# Altium schematic sheet ADCMP.SchDoc
size A4; SheetNumber: 4; SheetTotal: 5
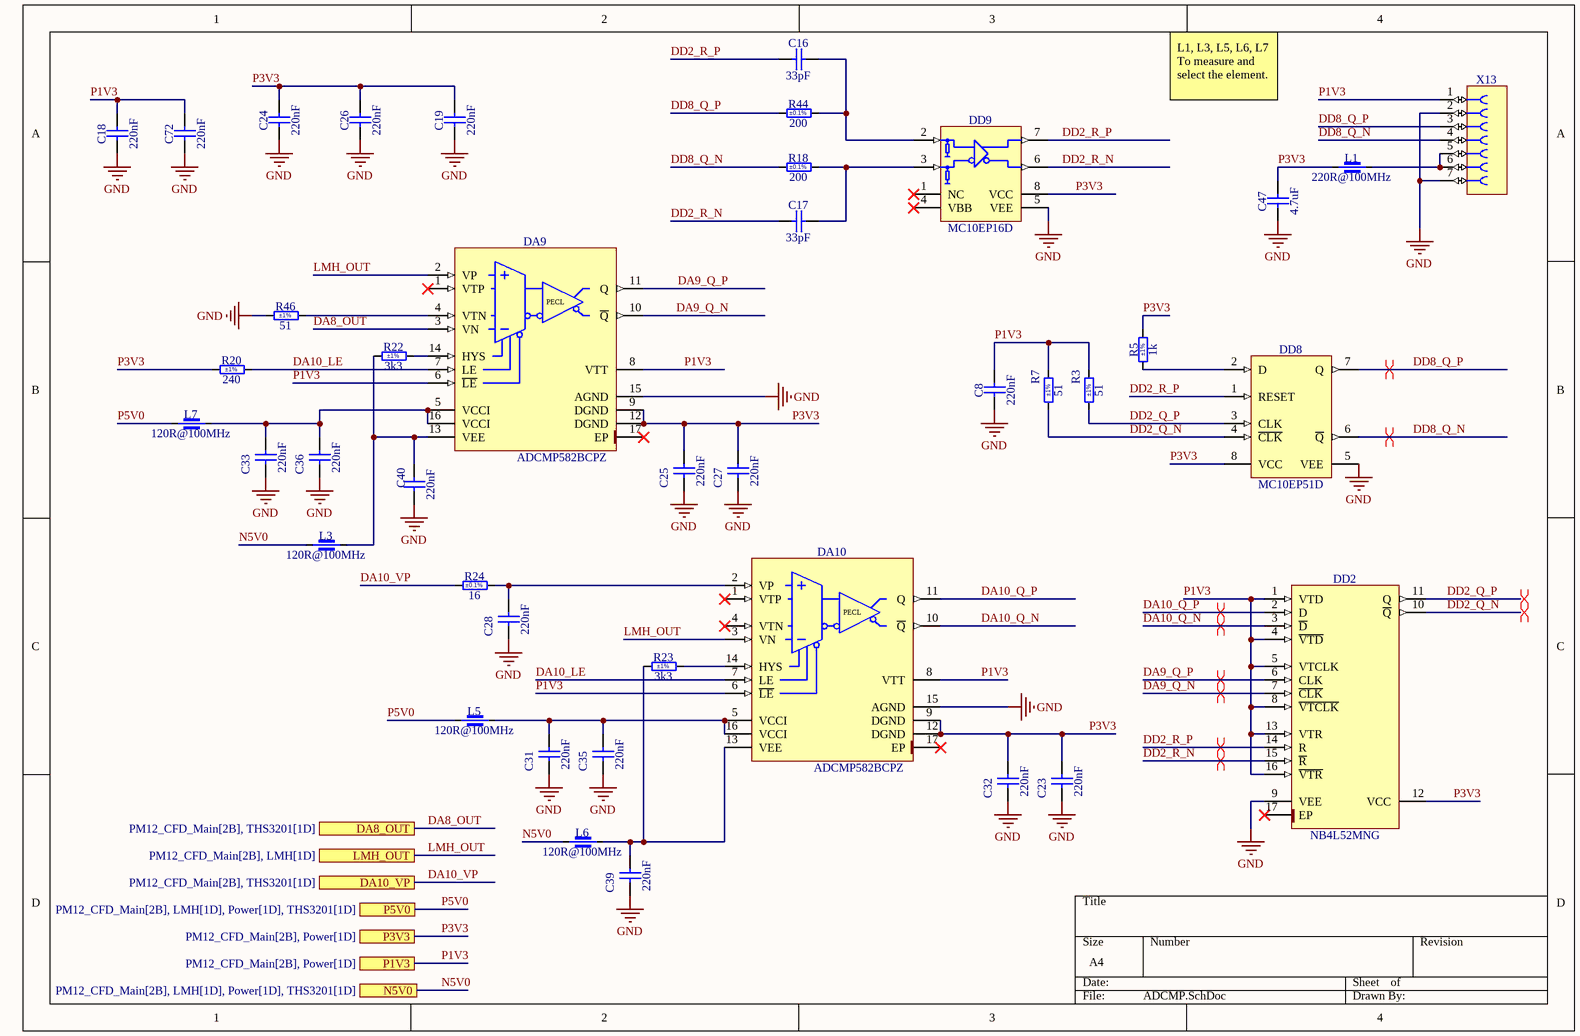
[diagram p0: ADCMP.SchDoc]

## Parts
C8  220nF  [CAPC2012X135N]
C16  33pF  [CAPC2012X135N]
C17  33pF  [CAPC2012X135N]
C18  220nF  [CAPC1608X87N]
C19  220nF  [CAPC2012X135N]
C23  220nF  [CAPC1608X87N]
C24  220nF  [CAPC2012X135N]
C25  220nF  [CAPC1608X87N]
C26  220nF  [CAPC2012X135N]
C27  220nF  [CAPC1608X87N]
C28  220nF  [CAPC1608X87N]
C31  220nF  [CAPC1608X87N]
C32  220nF  [CAPC1608X87N]
C33  220nF  [CAPC1608X87N]
C35  220nF  [CAPC1608X87N]
C36  220nF  [CAPC1608X87N]
C39  220nF  [CAPC1608X87N]
C40  220nF  [CAPC1608X87N]
C47  4.7uF  [CAPC3216X180N]
C72  220nF  [CAPC2012X135N]
DA9  ADCMP582BCPZ  [QFN50P300X300X80-17N-S145]
DA10  ADCMP582BCPZ  [QFN50P300X300X80-17N-S145]
DD2  NB4L52MNG  [QFN50P300X300X100-17N-S185]
DD8  MC10EP51D  [SOIC127P600X175-8N]
DD9  MC10EP16D  [SOIC127P600X175-8N]
L1  220R@100MHz  [INDC2012X105N]
L3  120R@100MHz  [INDC1608X95N]
L5  120R@100MHz  [INDC1608X95N]
L6  120R@100MHz  [INDC1608X95N]
L7  120R@100MHz  [INDC1608X95N]
R3  51  Tolerance: ±1%  [RESC2012X60N]
R5  1k  Tolerance: ±1%  [RESC2012X60N]
R7  51  Tolerance: ±1%  [RESC2012X60N]
R18  200  Tolerance: ±0.1%  [RESC2012X60N]
R20  240  Tolerance: ±1%  [RESC1608X55N]
R22  3k3  Tolerance: ±1%  [RESC1608X55N]
R23  3k3  Tolerance: ±1%  [RESC1608X55N]
R24  16  Tolerance: ±0.1%  [RESC1608X64N]
R44  200  Tolerance: ±0.1%  [RESC2012X60N]
R46  51  Tolerance: ±1%  [RESC1608X55N]
X13  Socket 7  [SAMTEC_CES-107-01-T-S]  (value not drawn)

## Ports
DA8_OUT (see PM12_CFD_Main[2B], THS3201[1D]), DA10_VP (see PM12_CFD_Main[2B], THS3201[1D]), LMH_OUT (see PM12_CFD_Main[2B], LMH[1D]), N5V0 (see PM12_CFD_Main[2B], LMH[1D], Power[1D], THS3201[1D]), P1V3 (see PM12_CFD_Main[2B], Power[1D]), P3V3 (see PM12_CFD_Main[2B], Power[1D]), P5V0 (see PM12_CFD_Main[2B], LMH[1D], Power[1D], THS3201[1D])

## Nets
GND: C8.1 C18.1 C19.1 C23.1 C24.1 C25.1 C26.1 C27.1 C28.1 C31.1 C32.1 C33.1 C35.1 C36.1 C39.1 C40.1 C47.1 C72.1 DA9.15(AGND) DA10.15(AGND) DD2.9(VEE) DD8.5(VEE) DD9.5(VEE) R46.1 X13.2 X13.7
DA8_OUT: DA9.3(VN) ; port DA8_OUT
DA9_Q_N: DA9.10(~{Q}) DD2.7(~{CLK})
DA9_Q_P: DA9.11(Q) DD2.6(CLK)
DA10_LE: DA9.7(LE) DA10.7(LE) R20.2
DA10_Q_N: DA10.10(~{Q}) DD2.3(~{D})
DA10_Q_P: DA10.11(Q) DD2.2(D)
DA10_VP: R24.1 ; port DA10_VP
DD2_Q_N: DD2.10(~{Q}) DD8.4(~{CLK}) R7.1
DD2_Q_P: DD2.11(Q) DD8.3(CLK) R3.1
DD2_R_N: C17.1 DD2.15(~{R}) DD9.6(~{Q})
DD2_R_P: C16.1 DD2.14(R) DD8.1(RESET) DD9.7(Q)
DD8_Q_N: DD8.6(~{Q}) R18.1 X13.4
DD8_Q_P: DD8.7(Q) R44.1 X13.3
LMH_OUT: DA9.2(VP) DA10.3(VN) ; port LMH_OUT
N5V0: L3.1 L6.1 ; port N5V0
P1V3: C8.2 C18.2 C72.2 DA9.6(~{LE}) DA9.8(VTT) DA10.6(~{LE}) DA10.8(VTT) DD2.1(VTD) DD2.4(~{VTD}) DD2.5(VTCLK) DD2.8(~{VTCLK}) DD2.13(VTR) DD2.16(~{VTR}) R3.2 R7.2 X13.1 ; port P1V3
P3V3: C19.2 C23.2 C24.2 C25.2 C26.2 C27.2 C32.2 C47.2 DA9.9(DGND) DA9.12(DGND) DA10.9(DGND) DA10.12(DGND) DD2.12(VCC) DD8.8(VCC) DD9.8(VCC) L1.1 R5.2 R20.1 ; port P3V3
P5V0: L5.1 L7.1 ; port P5V0
NetC16_2: C16.2 DD9.2(D0) R44.2
NetC17_2: C17.2 DD9.3(~{D0}) R18.2
NetC28_2: C28.2 DA10.2(VP) R24.2
NetC31_2: C31.2 C35.2 DA10.5(VCCI) DA10.16(VCCI) L5.2
NetC33_2: C33.2 C36.2 DA9.5(VCCI) DA9.16(VCCI) L7.2
NetC39_2: C39.2 DA10.13(VEE) L6.2 R23.1
NetC40_2: C40.2 DA9.13(VEE) L3.2 R22.1
NetDA9_4: DA9.4(VTN) R46.2
NetDA9_14: DA9.14(HYS) R22.2
NetDA10_14: DA10.14(HYS) R23.2
NetDD8_2: DD8.2(D) R5.1
NetL1_2: L1.2 X13.5 X13.6

Not connected (* = marked no-connect by the designer): DA9 1(VTP)* 17(EP)*; DA10 1(VTP)* 4(VTN)* 17(EP)*; DD2 17(EP)*; DD9 1(NC)* 4(VBB)*

## Layout directives
differential pair: DA9_Q_N, DA9_Q_P, DA10_Q_N, DA10_Q_P, DD2_Q_N, DD2_Q_P, DD2_R_N, DD2_R_P, DD8_Q_N, DD8_Q_P

## Notes on the sheet
- L1, L3, L5, L6, L7 To measure and select the element.
- (in symbol ADCMP582BCPZ) PECL

## Library data of the parts
C8 C19 C24 C26 C72 = CC0805_220NF_50V_10%_X7R: Non-polarised capacitor; Part Description: SMD Multilayer Chip Ceramic Capacitor; Manufacturer: GENERIC; Manufacturer1 Part Number: GRM21BR71H224KA01L; Voltage: 50V; TC: X7R; Tolerance: ±10%; Part Number: CC0805_220NF_50V_10%_X7R; Component Kind: Standard; Component Type: Standard; Pin Count: 2; Value: 220nF; Status: Preferred; Manufacturer Part Number: CC0805_220NF_50V_10%_X7R; Case: 0805; Mounted: Yes; Socket: No; SMD: Yes; Sense: No; Manufacturer1 Example: MURATA; Manufacturer1 ComponentHeight: 1.35mm; HelpURL: \\cern.ch\dfs\Applications\Altium\Datasheets\CC0805_X7R_MURATA.pdf; Author: CERN DEM JLC; CreateDate: 03.12.2007; LatestRevisionDate: 03.12.2007
C16 C17 = CC0805_33PF_50V_5%_NP0: Non-polarised capacitor; Part Description: SMD Multilayer Chip Ceramic Capacitor; Manufacturer: GENERIC; Manufacturer1 Part Number: 223886115339; Voltage: 50V; TC: C0G/NP0; Tolerance: ±5%; Part Number: CC0805_33PF_50V_5%_NP0; Component Kind: Standard; Component Type: Standard; Pin Count: 2; Value: 33pF; Status: Preferred; Manufacturer Part Number: CC0805_33PF_50V_5%_NP0; Case: 0805; Mounted: Yes; Socket: No; SMD: Yes; Sense: No; Manufacturer1 Example: PHYCOMP; Manufacturer1 ComponentHeight: 1.35mm; HelpURL: \\cern.ch\dfs\Applications\Altium\Datasheets\CC0805_NP0_PHYCOMP.pdf; Author: CERN DEM JLC; CreateDate: 03.12.2007; LatestRevisionDate: 03.12.2007
C18 C23 C25 C27 C28 C31-C33 C35 C36 C39 C40 = CC0603_220NF_25V_10%_X7R: Non-polarised capacitor; Part Description: SMD Multilayer Chip Ceramic Capacitor; Manufacturer: GENERIC; Manufacturer1 Part Number: C0603C224K3RACTU; Voltage: 25V; TC: X7R; Tolerance: ±10%; Part Number: CC0603_220NF_25V_10%_X7R; Component Kind: Standard; Component Type: Standard; Pin Count: 2; Value: 220nF; Status: Preferred; Manufacturer Part Number: CC0603_220NF_25V_10%_X7R; Case: 0603; Mounted: Yes; Socket: No; SMD: Yes; Sense: No; Manufacturer1 Example: KEMET; Manufacturer1 ComponentHeight: 0.87mm; HelpURL: \\cern.ch\dfs\Applications\Altium\Datasheets\CC0603_X7R_KEMET.pdf; Author: CERN DEM JLC; CreateDate: 29.10.2014; LatestRevisionDate: 29.10.2014
C47 = CC1206_4.7UF_25V_10%_X7R: Non-polarised capacitor; Part Description: SMD Multilayer Chip Ceramic Capacitor; Manufacturer: GENERIC; Manufacturer1 Part Number: C1206C475K3RAC; Voltage: 25V; TC: X7R; Tolerance: ±10%; Part Number: CC1206_4.7UF_25V_10%_X7R; Component Kind: Standard; Component Type: Standard; Pin Count: 2; Value: 4.7uF; Status: Preferred; Manufacturer Part Number: CC1206_4.7UF_25V_10%_X7R; Case: 1206; Mounted: Yes; Socket: No; SMD: Yes; Sense: No; Manufacturer1 Example: KEMET; Manufacturer1 ComponentHeight: 1.8mm; HelpURL: \\cern.ch\dfs\Applications\Altium\Datasheets\CC1206_X7R_KEMET.pdf; Author: CERN DEM WB; CreateDate: 25.07.2018; LatestRevisionDate: 25.07.2018
DA9 DA10 = ADCMP582BCPZ: Ultrafast SiGe Voltage Comparator; Manufacturer: ANALOG DEVICES; PressFit: No; Bonding: No; Part Number: ADCMP582BCPZ; Component Kind: Standard; Component Type: Standard; Device: ADCMP582BCPZ; PackageDescription: QFN, 0.50mm Pitch, Square; 16 Pin, 3.00mm L X 3.00mm W X 0.80mm H body (w/Thermal Tab 1.45 X 1.45mm), IPC Medium Density; Part Description: Ultrafast SiGe Voltage Comparator; Manufacturer Part Number: ADCMP582BCP; Pin Count: 17; Case: QFN16; Mounted: Yes; Socket: No; SMD: Yes; Sense: No; ComponentHeight: 0.8mm; Author: CERN DEM MR; HelpURL: \\cern.ch\dfs\Applications\Altium\Datasheets\ADCMP582BCPZ.pdf; CreateDate: 23.01.2018; LatestRevisionDate: 31.03.2022
DD2 = NB4L52MNG: 2.5 V/3.3 V/5.0 V Differential Data/Clock D Flip-Flop with Reset; Manufacturer: ON SEMICONDUCTOR; PressFit: No; Bonding: No; Part Number: NB4L52MNG; Component Kind: Standard; Component Type: Standard; Device: NB4L52MNG; PackageDescription: QFN, 0.50mm Pitch, Square; 16 Pin, 3.00mm L X 3.00mm W X 1.00mm H body (w/Thermal Tab 1.85 X 1.85mm), IPC Medium Density; Part Description: 2.5 V/3.3 V/5.0 V Differential Data/Clock D Flip-Flop with Reset; Manufacturer Part Number: NB4L52MN; Pin Count: 16; Case: QFN16; Mounted: Yes; Socket: No; SMD: Yes; Sense: No; ComponentHeight: 1mm; Author: CERN DEM MR; HelpURL: \\cern.ch\dfs\Applications\Altium\Datasheets\NB4L52MNG.pdf; CreateDate: 15.01.2016; LatestRevisionDate: 04.04.2022
DD8 = MC10EP51D: 3.3V/5V ECL D Flip-Flop with Reset and Differential Clock; Manufacturer: ON SEMICONDUCTOR; PressFit: No; Bonding: No; Part Number: MC10EP51D; Component Kind: Standard; Component Type: Standard; Device: MC10EP51D; PackageDescription: SOIC 8, Pitch 1.27mm - Body 4x5mm, IPC Medium Density; Part Description: 3.3V/5V ECL D Flip-Flop with Reset and Differential Clock; Manufacturer Part Number: MC10EP51D; Pin Count: 8; Case: SOIC8; Mounted: Yes; Socket: No; SMD: Yes; Sense: No; ComponentHeight: 1.75mm; Author: CERN DEM HF; HelpURL: \\cern.ch\dfs\Applications\Altium\Datasheets\MC10EP51.pdf; CreateDate: 25.04.2024; LatestRevisionDate: 25.04.2024
DD9 = MC10EP16D: 3.3V / 5V ECL Differential Receiver/Driver; Manufacturer: ON SEMICONDUCTOR; PressFit: No; Bonding: No; Part Number: MC10EP16D; Component Kind: Standard; Component Type: Standard; Device: MC10EP16D; PackageDescription: SOIC 8, Pitch 1.27mm - Body 4x5mm, IPC Medium Density; Part Description: 3.3V/5V ECL Differential Receiver/Driver; Manufacturer Part Number: MC10EP16D; Pin Count: 8; Case: SOIC8; Mounted: Yes; Socket: No; SMD: Yes; Sense: No; ComponentHeight: 1.75mm; Author: CERN DEM HF; HelpURL: \\cern.ch\dfs\Applications\Altium\Datasheets\MC10EP16.pdf; CreateDate: 25.04.2024; LatestRevisionDate: 25.04.2024
L1 = IND0805_TDK_MPZ2012S221A: Part Description: SMT Chip Bead for General Power Line (MPZ Series); Manufacturer: TDK; Power: 3A; Resistance: 0.04R; Tolerance: ±25%; Part Number: IND0805_TDK_MPZ2012S221A; Component Kind: Standard; Component Type: Standard; Pin Count: 2; Value: 220R@100MHz; Manufacturer Part Number: MPZ2012S221A; Case: 0805; Mounted: Yes; Socket: No; SMD: Yes; Sense: No; ComponentHeight: 1.05mm; HelpURL: \\cern.ch\dfs\Applications\Altium\Datasheets\IND0805_TDK_MPZ2012.pdf; Author: CERN DEM HF; CreateDate: 04.10.2021; LatestRevisionDate: 04.10.2021
L3 L5-L7 = IND0603_MURATA_BLM18PG121SN1D: Part Description: SMD EMIFIL Chip Ferrite Bead; Manufacturer: MURATA; Power: 2A; Resistance: 0.05R; Part Number: IND0603_MURATA_BLM18PG121SN1D; Component Kind: Standard; Component Type: Standard; Pin Count: 2; Value: 120R@100MHz; Manufacturer Part Number: BLM18PG121SN1D; Case: 0603; Mounted: Yes; Socket: No; SMD: Yes; Sense: No; ComponentHeight: 0.95mm; HelpURL: \\cern.ch\dfs\Applications\Altium\Datasheets\IND0603_MURATA_BLM18P.pdf; Author: CERN DEM BC; CreateDate: 27.07.2015; LatestRevisionDate: 25.10.2018
R3 R7 = R0805_51R_1%_0.125W_100PPM: Resistor - 1%; Part Description: General Purpose Thick Film Chip Resistor; Manufacturer: GENERIC; Manufacturer1 Part Number: NRC10F51R0TRF; Power: 0.125W; TC: ±100ppm/°C; PressFit: No; Part Number: R0805_51R_1%_0.125W_100PPM; Component Kind: Standard; Component Type: Standard; Pin Count: 2; Value: 51; Status: Preferred; Manufacturer Part Number: R0805_51R_1%_0.125W_100PPM; Case: 0805; Mounted: Yes; Sense: No; Socket: No; SMD: Yes; Manufacturer1 Example: NIC COMPONENT; Manufacturer1 ComponentHeight: 0.6mm; HelpURL: \\cern.ch\dfs\Applications\Altium\Datasheets\R0805_NIC_NRC.pdf; Author: CERN DEM JLC; CreateDate: 03.12.2007; LatestRevisionDate: 13.03.2008
R5 = R0805_1K_1%_0.125W_100PPM: Resistor - 1%; Part Description: General Purpose Thick Film Chip Resistor; Manufacturer: GENERIC; Manufacturer1 Part Number: NRC10F1001TRF; Power: 0.125W; TC: ±100ppm/°C; PressFit: No; Part Number: R0805_1K_1%_0.125W_100PPM; Component Kind: Standard; Component Type: Standard; Pin Count: 2; Value: 1k; Status: Preferred; Manufacturer Part Number: R0805_1K_1%_0.125W_100PPM; Case: 0805; Mounted: Yes; Sense: No; Socket: No; SMD: Yes; Manufacturer1 Example: NIC COMPONENT; Manufacturer1 ComponentHeight: 0.6mm; HelpURL: \\cern.ch\dfs\Applications\Altium\Datasheets\R0805_NIC_NRC.pdf; Author: CERN DEM JLC; CreateDate: 03.12.2007; LatestRevisionDate: 13.03.2008
R18 R44 = R0805_200R_0.1%_0.1W_10PPM: Resistor - 0.1%; Part Description: Thin Film Chip Resistor; Manufacturer: GENERIC; Manufacturer1 Part Number: RN73C2A200RBTG; Power: 0.1W; TC: ±10ppm; PressFit: No; Part Number: R0805_200R_0.1%_0.1W_10PPM; Component Kind: Standard; Component Type: Standard; Pin Count: 2; Value: 200; Status: Not Recommended; Manufacturer Part Number: R0805_200R_0.1%_0.1W_10PPM; Case: 0805; Mounted: Yes; Sense: No; Socket: No; SMD: Yes; Manufacturer1 Example: TYCO HOLSWORTHY; Manufacturer1 ComponentHeight: 0.6mm; HelpURL: \\cern.ch\dfs\Applications\Altium\Datasheets\R0805_Tyco_RN73.pdf; Author: CERN DEM JLC; CreateDate: 03.12.2007; LatestRevisionDate: 13.03.2008
R20 = R0603_240R_1%_0.1W_100PPM: Resistor - 1%; Part Description: General Purpose Thick Film Chip Resistor; Manufacturer: GENERIC; Manufacturer1 Part Number: NRC06F2400TRF; Power: 0.1W; TC: ±100ppm/°C; PressFit: No; Part Number: R0603_240R_1%_0.1W_100PPM; Component Kind: Standard; Component Type: Standard; Pin Count: 2; Value: 240; Status: Preferred; Manufacturer Part Number: R0603_240R_1%_0.1W_100PPM; Case: 0603; Mounted: Yes; Sense: No; Socket: No; SMD: Yes; Manufacturer1 Example: NIC COMPONENT; Manufacturer1 ComponentHeight: 0.55mm; HelpURL: \\cern.ch\dfs\Applications\Altium\Datasheets\R0603_NIC_NRC.pdf; Author: CERN DEM JLC; CreateDate: 03.12.2007; LatestRevisionDate: 13.03.2008
R22 R23 = R0603_3K3_1%_0.1W_100PPM: Resistor - 1%; Part Description: General Purpose Thick Film Chip Resistor; Manufacturer: GENERIC; Manufacturer1 Part Number: NRC06F3301TRF; Power: 0.1W; TC: ±100ppm/°C; PressFit: No; Part Number: R0603_3K3_1%_0.1W_100PPM; Component Kind: Standard; Component Type: Standard; Pin Count: 2; Value: 3k3; Status: Preferred; Manufacturer Part Number: R0603_3K3_1%_0.1W_100PPM; Case: 0603; Mounted: Yes; Sense: No; Socket: No; SMD: Yes; Manufacturer1 Example: NIC COMPONENT; Manufacturer1 ComponentHeight: 0.55mm; HelpURL: \\cern.ch\dfs\Applications\Altium\Datasheets\R0603_NIC_NRC.pdf; Author: CERN DEM JLC; CreateDate: 03.12.2007; LatestRevisionDate: 13.03.2008
R24 = R0603_16R_0.1%_0.1W_10PPM: Resistor - 0.1%; Part Description: Thin Film Chip Resistor; Manufacturer: GENERIC; Manufacturer1 Part Number: RT0603BRB0716RL; Power: 0.1W; TC: ±10ppm/°C; PressFit: No; Part Number: R0603_16R_0.1%_0.1W_10PPM; Component Kind: Standard; Component Type: Standard; Pin Count: 2; Value: 16; Status: Not Recommended; Manufacturer Part Number: R0603_16R_0.1%_0.1W_10PPM; Case: 0603; Mounted: Yes; Sense: No; Socket: No; SMD: Yes; Manufacturer1 Example: YAGEO; Manufacturer1 ComponentHeight: 0.55mm; HelpURL: \\cern.ch\dfs\Applications\Altium\Datasheets\R0603_YAGEO_RT.pdf; Author: CERN DEM HF; CreateDate: 25.04.2024; LatestRevisionDate: 25.04.2024
R46 = R0603_51R_1%_0.1W_100PPM: Resistor - 1%; Part Description: General Purpose Thick Film Chip Resistor; Manufacturer: GENERIC; Manufacturer1 Part Number: NRC06F51R0TRF; Power: 0.1W; TC: ±100ppm/°C; PressFit: No; Part Number: R0603_51R_1%_0.1W_100PPM; Component Kind: Standard; Component Type: Standard; Pin Count: 2; Value: 51; Status: Preferred; Manufacturer Part Number: R0603_51R_1%_0.1W_100PPM; Case: 0603; Mounted: Yes; Sense: No; Socket: No; SMD: Yes; Manufacturer1 Example: NIC COMPONENT; Manufacturer1 ComponentHeight: 0.55mm; HelpURL: \\cern.ch\dfs\Applications\Altium\Datasheets\R0603_NIC_NRC.pdf; Author: CERN DEM JLC; CreateDate: 03.12.2007; LatestRevisionDate: 13.03.2008
X13 = SAMTEC_CES-107-01-L-S: Connector 7 Female; Part Description: 7 Contacts, Pitch 2.54mm, Single Row Through Mount Straight Socket (Lead Length 3.25mm); Manufacturer: SAMTEC; PressFit: No; Author: CERN DEM HF; Part Number: SAMTEC_CES-107-01-L-S; Component Kind: Standard; Component Type: Standard; Pin Count: 7; Family: Socket 7; Mounted: Yes; Socket: No; SMD: No; Sense: No; Status: None; Manufacturer Part Number: CES-107-01-L-S; ComponentHeight: 5.08mm; HelpURL: \\cern.ch\dfs\Applications\Altium\Datasheets\SAMTEC_CES-107-01-T-S.pdf; CreateDate: 25.04.2024; LatestRevisionDate: 25.04.2024